# Altium schematic sheet shcNhung.SchDoc
size A
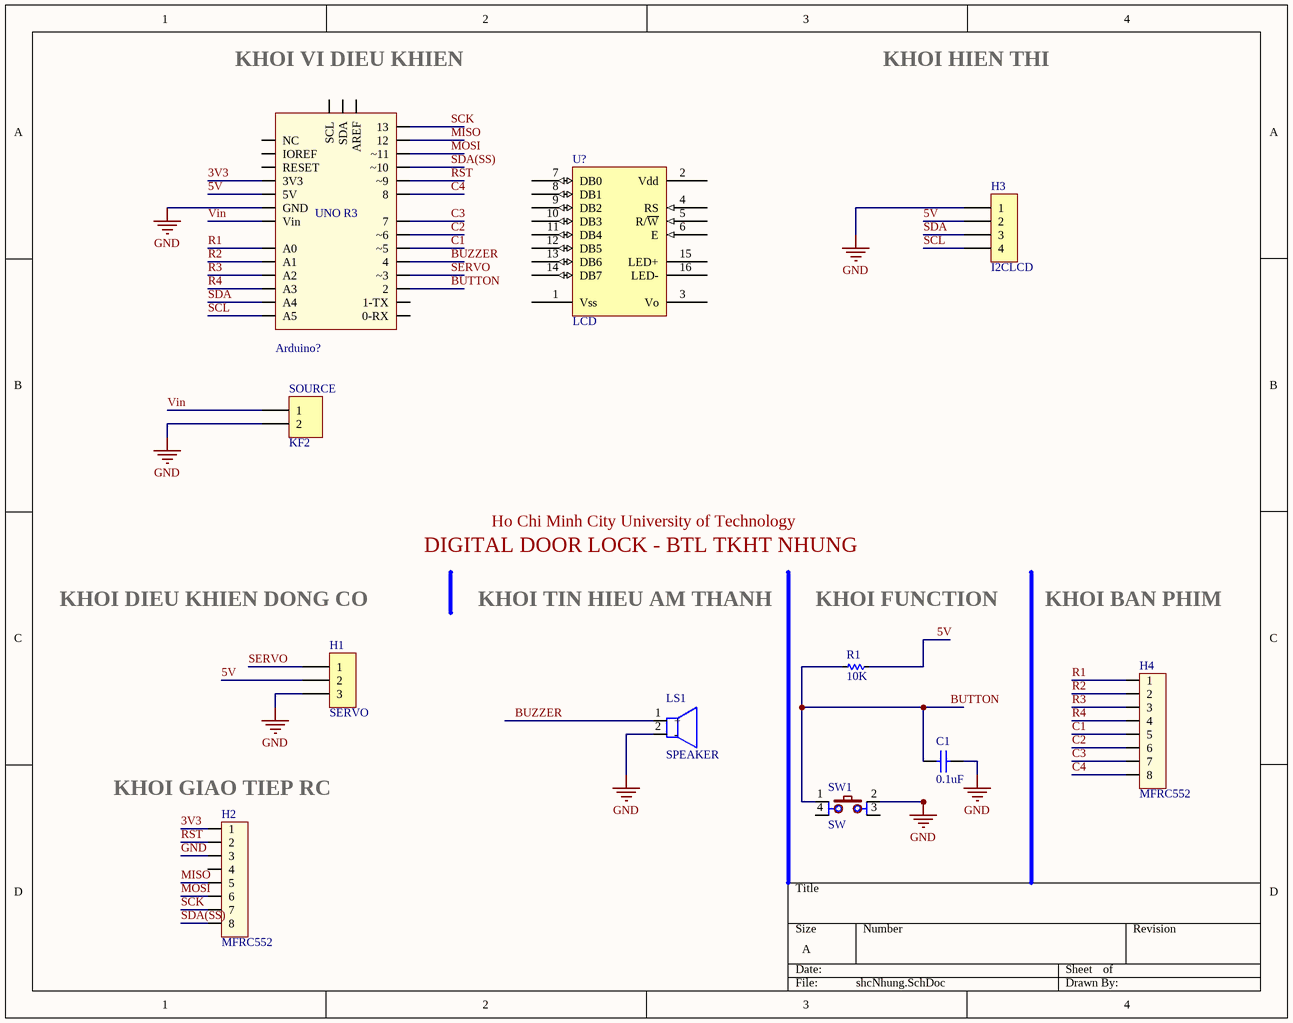
[diagram p0: shcNhung.SchDoc]

## Parts
Arduino?  Arduino Uno R3  [Arduino UNO R3]  (value not drawn)
C1  0.1uF  [tu tantalum dip5.08]
H1  SERVO  [XH2.54M-3]
H2  MFRC552  [XH2.54M-8]
H3  I2CLCD  [XH2.54M-4]
H4  MFRC552  [XH2.54M-8]
LS1  SPEAKER  [speaker]
R1  10K  [RES-1/2W]
SOURCE  KF2  [KF2-3.5]
SW1  SW  [SW2-DIP]
U?  LCD  [LCD-16x2]

## Nets
GND: Arduino?.GND C1.1 H1.3 H2.3 H3.1 LS1.2(-) SOURCE.2 SW1.2
3V3: Arduino?.3V3 H2.1
5V: Arduino?.5V H1.2 H3.2 R1.1
BUTTON: Arduino?.2 C1.2 R1.2 SW1.1
BUZZER: Arduino?.4 LS1.1(+)
C1: Arduino?.~5 H4.5
C2: Arduino?.~6 H4.6
C3: Arduino?.7 H4.7
C4: Arduino?.8 H4.8
MISO: Arduino?.12 H2.5
MOSI: Arduino?.~11 H2.6
R1: Arduino?.A0 H4.1
R2: Arduino?.A1 H4.2
R3: Arduino?.A2 H4.3
R4: Arduino?.A3 H4.4
RST: Arduino?.~9 H2.2
SCK: Arduino?.13 H2.7
SCL: Arduino?.A5 H3.4
SDA: Arduino?.A4 H3.3
SDA(SS): Arduino?.~10 H2.8
SERVO: Arduino?.~3 H1.1
Vin: Arduino?.Vin SOURCE.1

Not connected (* = marked no-connect by the designer): Arduino? 0-RX 1-TX AREF IOREF NC RESET SCL SDA; H2 4; SW1 3 4; U? 1(Vss) 2(Vdd) 3(Vo) 4(RS) 5(R/~{W}) 6(E) 7(DB0) 8(DB1) 9(DB2) 10(DB3) 11(DB4) 12(DB5) 13(DB6) 14(DB7) 15(LED+) 16(LED-)

## Notes on the sheet
- (near Arduino?) KHOI VI DIEU KHIEN
- KHOI HIEN THI
- DIGITAL DOOR LOCK - BTL TKHT NHUNG
- Ho Chi Minh City University of Technology
- KHOI DIEU KHIEN DONG CO
- KHOI TIN HIEU AM THANH
- KHOI FUNCTION
- KHOI BAN PHIM
- (near H2) KHOI GIAO TIEP RC
- (in symbol Arduino Uno R3) UNO R3

## Library data of the parts
Arduino? = Arduino Uno R3: Value: Cau 1A
C1 = Tu tantalum 10nF DIP5.08: Cắm; Don_Vi: Con; So_Chan: 2; Ten_Linh_Kien: Tụ tantalum 103-10nF DIP5.08 (sứ vàng)(10PCS); Ma_Hang: MH002105; Chung_Loai: Cắm; Kieu_Chan: *
H1 = Header 3P 2.54 Duc Thang: Cắm; Ten_Linh_Kien: Header 3P XH2.54-3P Đực Thẳng; Don_Vi: Con; Ma_Hang: MH001292; Chung_Loai: Cắm
H2 H4 = Header 8P 2.54 Duc Thang: Cắm; Ten_Linh_Kien: Header 8P XH2.54-8P Đực Thẳng; Don_Vi: Con; Ma_Hang: MH003366; Chung_Loai: Cắm
H3 = Header 4P 2.54 Duc Thang: Cắm; Ten_Linh_Kien: Header 4P XH2.54-4P Đực Thẳng; Don_Vi: Con; Ma_Hang: MH001285; Chung_Loai: Cắm
LS1 = SPEAKER: Vendor: Digikey; Published: 13-April-2009; Publisher: Hoang Nguyen; ComponentLink1Description: Digikey Part Link; ComponentLink2Description: Open Datasheet; ComponentLink2URL: H:\LIBRARY\LIBRARY.Datasheet\
R1 = Res: Manufacturer: Generic Components; Class: Passive; SubClass: R; Published: 08/06/2000; Publisher: Altium Hobart Technology Centre
SOURCE = KF2: Manufacturer: Würth Elektronik eiSos GmbH; partNo: 691103110002; ComponentLink1 Description: Manufacturer; ComponentLink2 Description: Datasheet; NoPins: 2; Created Date: 29 October 2013; ComponentLink1URL: http://www.we-online.com; ComponentLink2URL: http://katalog.we-online.de/em/datasheet/6911031100xx.pdf; Created by: Karrer Zheng
SW1 = SW4: Switch button 4 pin; Value: Button chip 4 pin
U? = LCD: Character LCD, HD44780, 16-pin